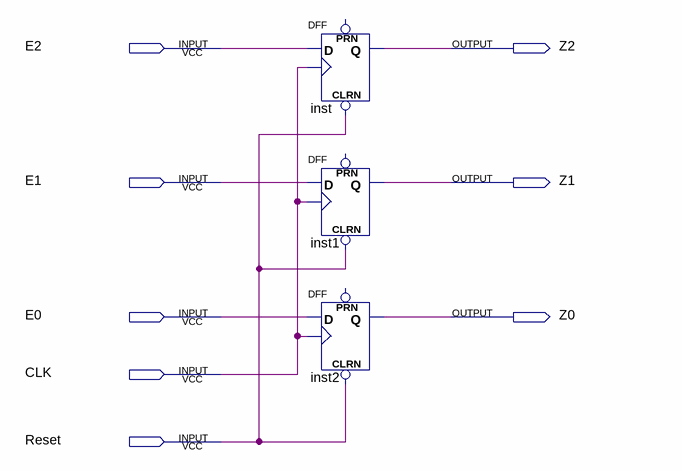
[diagram p0: schematic sheet]
// Quartus schematic Registrador3bits.bdf as structural Verilog: 3 symbols, 8 pins
module Registrador3bits (
  input  E2,
  input  E1,
  input  E0,
  input  CLK,
  input  Reset,
  output Z2,
  output Z1,
  output Z0
);

  DFF inst (.CLRN(Reset), .CLK(CLK), .D(E2), .Q(Z2));  // open: PRN
  DFF inst1 (.CLRN(Reset), .CLK(CLK), .D(E1), .Q(Z1));  // open: PRN
  DFF inst2 (.CLRN(Reset), .CLK(CLK), .D(E0), .Q(Z0));  // open: PRN
endmodule
